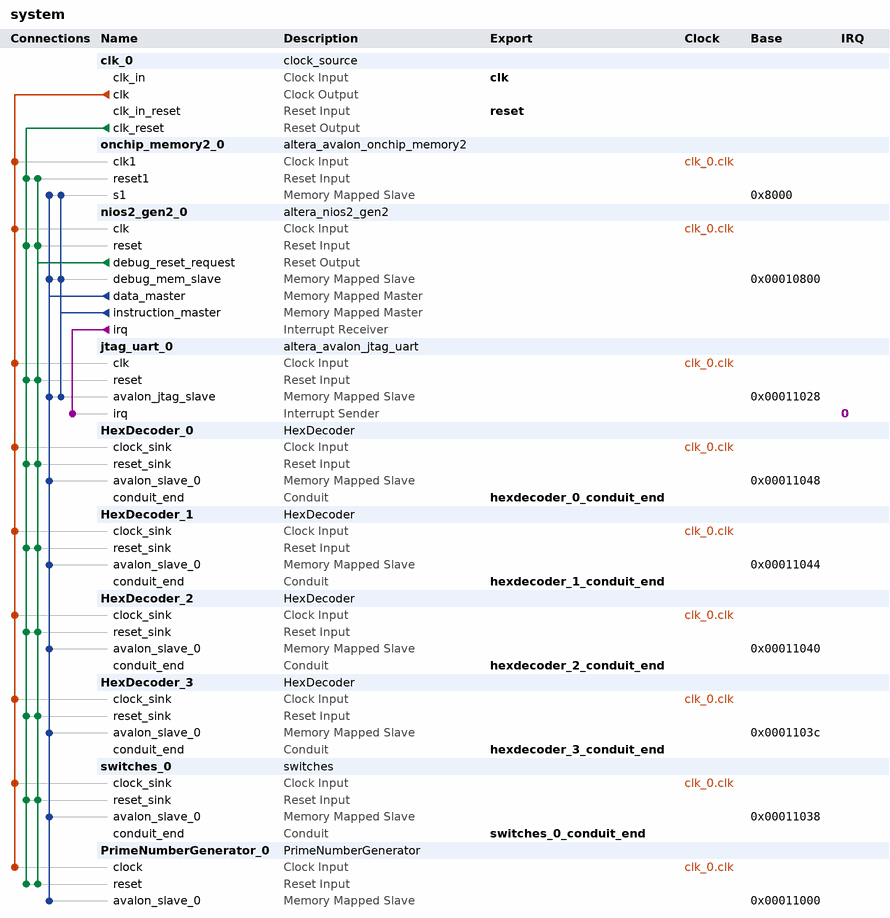
[diagram p0: system contents]
# Platform Designer (Qsys) system system, Cyclone V 5CSXFC6D6F31C6
# Parameters at their usual value, and those the tool derives, are not listed.
package require -exact qsys 18.1
create_system system
set_project_property DEVICE_FAMILY {Cyclone V}
set_project_property DEVICE 5CSXFC6D6F31C6

add_instance clk_0 clock_source 18.1
set_instance_parameter_value clk_0 clockFrequency 50000000

add_instance onchip_memory2_0 altera_avalon_onchip_memory2 18.1
set_instance_parameter_value onchip_memory2_0 dataWidth 32
set_instance_parameter_value onchip_memory2_0 dualPort false
set_instance_parameter_value onchip_memory2_0 initMemContent true
set_instance_parameter_value onchip_memory2_0 initializationFileName onchip_mem.hex
set_instance_parameter_value onchip_memory2_0 memorySize 32768

add_instance nios2_gen2_0 altera_nios2_gen2 18.1
set_instance_parameter_value nios2_gen2_0 dcache_size 2048
set_instance_parameter_value nios2_gen2_0 exceptionSlave onchip_memory2_0.s1
set_instance_parameter_value nios2_gen2_0 icache_size 4096
set_instance_parameter_value nios2_gen2_0 impl Tiny
set_instance_parameter_value nios2_gen2_0 resetSlave onchip_memory2_0.s1

add_instance jtag_uart_0 altera_avalon_jtag_uart 18.1
set_instance_parameter_value jtag_uart_0 simInteractiveOptions NO_INTERACTIVE_WINDOWS

add_instance HexDecoder_0 HexDecoder 1.0

add_instance HexDecoder_1 HexDecoder 1.0

add_instance HexDecoder_2 HexDecoder 1.0

add_instance HexDecoder_3 HexDecoder 1.0

add_instance switches_0 switches 1.0

add_instance PrimeNumberGenerator_0 PrimeNumberGenerator 1.0

# connections
add_connection clk_0.clk HexDecoder_0.clock_sink clock
add_connection clk_0.clk HexDecoder_1.clock_sink clock
add_connection clk_0.clk HexDecoder_2.clock_sink clock
add_connection clk_0.clk HexDecoder_3.clock_sink clock
add_connection clk_0.clk jtag_uart_0.clk clock
add_connection clk_0.clk nios2_gen2_0.clk clock
add_connection clk_0.clk onchip_memory2_0.clk1 clock
add_connection clk_0.clk PrimeNumberGenerator_0.clock clock
add_connection clk_0.clk switches_0.clock_sink clock
add_connection clk_0.clk_reset HexDecoder_0.reset_sink reset
add_connection clk_0.clk_reset HexDecoder_1.reset_sink reset
add_connection clk_0.clk_reset HexDecoder_2.reset_sink reset
add_connection clk_0.clk_reset HexDecoder_3.reset_sink reset
add_connection clk_0.clk_reset jtag_uart_0.reset reset
add_connection clk_0.clk_reset nios2_gen2_0.reset reset
add_connection clk_0.clk_reset onchip_memory2_0.reset1 reset
add_connection clk_0.clk_reset PrimeNumberGenerator_0.reset reset
add_connection clk_0.clk_reset switches_0.reset_sink reset
add_connection nios2_gen2_0.debug_reset_request HexDecoder_0.reset_sink reset
add_connection nios2_gen2_0.debug_reset_request HexDecoder_1.reset_sink reset
add_connection nios2_gen2_0.debug_reset_request HexDecoder_2.reset_sink reset
add_connection nios2_gen2_0.debug_reset_request HexDecoder_3.reset_sink reset
add_connection nios2_gen2_0.debug_reset_request jtag_uart_0.reset reset
add_connection nios2_gen2_0.debug_reset_request nios2_gen2_0.reset reset
add_connection nios2_gen2_0.debug_reset_request onchip_memory2_0.reset1 reset
add_connection nios2_gen2_0.debug_reset_request PrimeNumberGenerator_0.reset reset
add_connection nios2_gen2_0.debug_reset_request switches_0.reset_sink reset
add_connection nios2_gen2_0.data_master HexDecoder_0.avalon_slave_0 avalon
set_connection_parameter_value nios2_gen2_0.data_master/HexDecoder_0.avalon_slave_0 baseAddress 0x00011048
add_connection nios2_gen2_0.data_master HexDecoder_1.avalon_slave_0 avalon
set_connection_parameter_value nios2_gen2_0.data_master/HexDecoder_1.avalon_slave_0 baseAddress 0x00011044
add_connection nios2_gen2_0.data_master HexDecoder_2.avalon_slave_0 avalon
set_connection_parameter_value nios2_gen2_0.data_master/HexDecoder_2.avalon_slave_0 baseAddress 0x00011040
add_connection nios2_gen2_0.data_master HexDecoder_3.avalon_slave_0 avalon
set_connection_parameter_value nios2_gen2_0.data_master/HexDecoder_3.avalon_slave_0 baseAddress 0x0001103c
add_connection nios2_gen2_0.data_master jtag_uart_0.avalon_jtag_slave avalon
set_connection_parameter_value nios2_gen2_0.data_master/jtag_uart_0.avalon_jtag_slave baseAddress 0x00011028
add_connection nios2_gen2_0.data_master nios2_gen2_0.debug_mem_slave avalon
set_connection_parameter_value nios2_gen2_0.data_master/nios2_gen2_0.debug_mem_slave baseAddress 0x00010800
add_connection nios2_gen2_0.data_master onchip_memory2_0.s1 avalon
set_connection_parameter_value nios2_gen2_0.data_master/onchip_memory2_0.s1 baseAddress 0x8000
add_connection nios2_gen2_0.data_master PrimeNumberGenerator_0.avalon_slave_0 avalon
set_connection_parameter_value nios2_gen2_0.data_master/PrimeNumberGenerator_0.avalon_slave_0 baseAddress 0x00011000
add_connection nios2_gen2_0.data_master switches_0.avalon_slave_0 avalon
set_connection_parameter_value nios2_gen2_0.data_master/switches_0.avalon_slave_0 baseAddress 0x00011038
add_connection nios2_gen2_0.instruction_master jtag_uart_0.avalon_jtag_slave avalon
set_connection_parameter_value nios2_gen2_0.instruction_master/jtag_uart_0.avalon_jtag_slave baseAddress 0x00011028
add_connection nios2_gen2_0.instruction_master nios2_gen2_0.debug_mem_slave avalon
set_connection_parameter_value nios2_gen2_0.instruction_master/nios2_gen2_0.debug_mem_slave baseAddress 0x00010800
add_connection nios2_gen2_0.instruction_master onchip_memory2_0.s1 avalon
set_connection_parameter_value nios2_gen2_0.instruction_master/onchip_memory2_0.s1 baseAddress 0x8000
add_connection nios2_gen2_0.irq jtag_uart_0.irq interrupt
set_connection_parameter_value nios2_gen2_0.irq/jtag_uart_0.irq irqNumber 0

# exported interfaces
add_interface clk clock sink
set_interface_property clk EXPORT_OF clk_0.clk_in
add_interface hexdecoder_0_conduit_end conduit end
set_interface_property hexdecoder_0_conduit_end EXPORT_OF HexDecoder_0.conduit_end
add_interface hexdecoder_1_conduit_end conduit end
set_interface_property hexdecoder_1_conduit_end EXPORT_OF HexDecoder_1.conduit_end
add_interface hexdecoder_2_conduit_end conduit end
set_interface_property hexdecoder_2_conduit_end EXPORT_OF HexDecoder_2.conduit_end
add_interface hexdecoder_3_conduit_end conduit end
set_interface_property hexdecoder_3_conduit_end EXPORT_OF HexDecoder_3.conduit_end
add_interface reset reset sink
set_interface_property reset EXPORT_OF clk_0.clk_in_reset
add_interface switches_0_conduit_end conduit end
set_interface_property switches_0_conduit_end EXPORT_OF switches_0.conduit_end

set_interconnect_requirement {$system} qsys_mm.clockCrossingAdapter HANDSHAKE
set_interconnect_requirement {$system} qsys_mm.enableEccProtection FALSE
set_interconnect_requirement {$system} qsys_mm.insertDefaultSlave FALSE
set_interconnect_requirement {$system} qsys_mm.maxAdditionalLatency 1

save_system system.qsys
